# EAGLE design -Y_panel_FM_2U_Ver1_v1 (EAGLE 9.6.2)
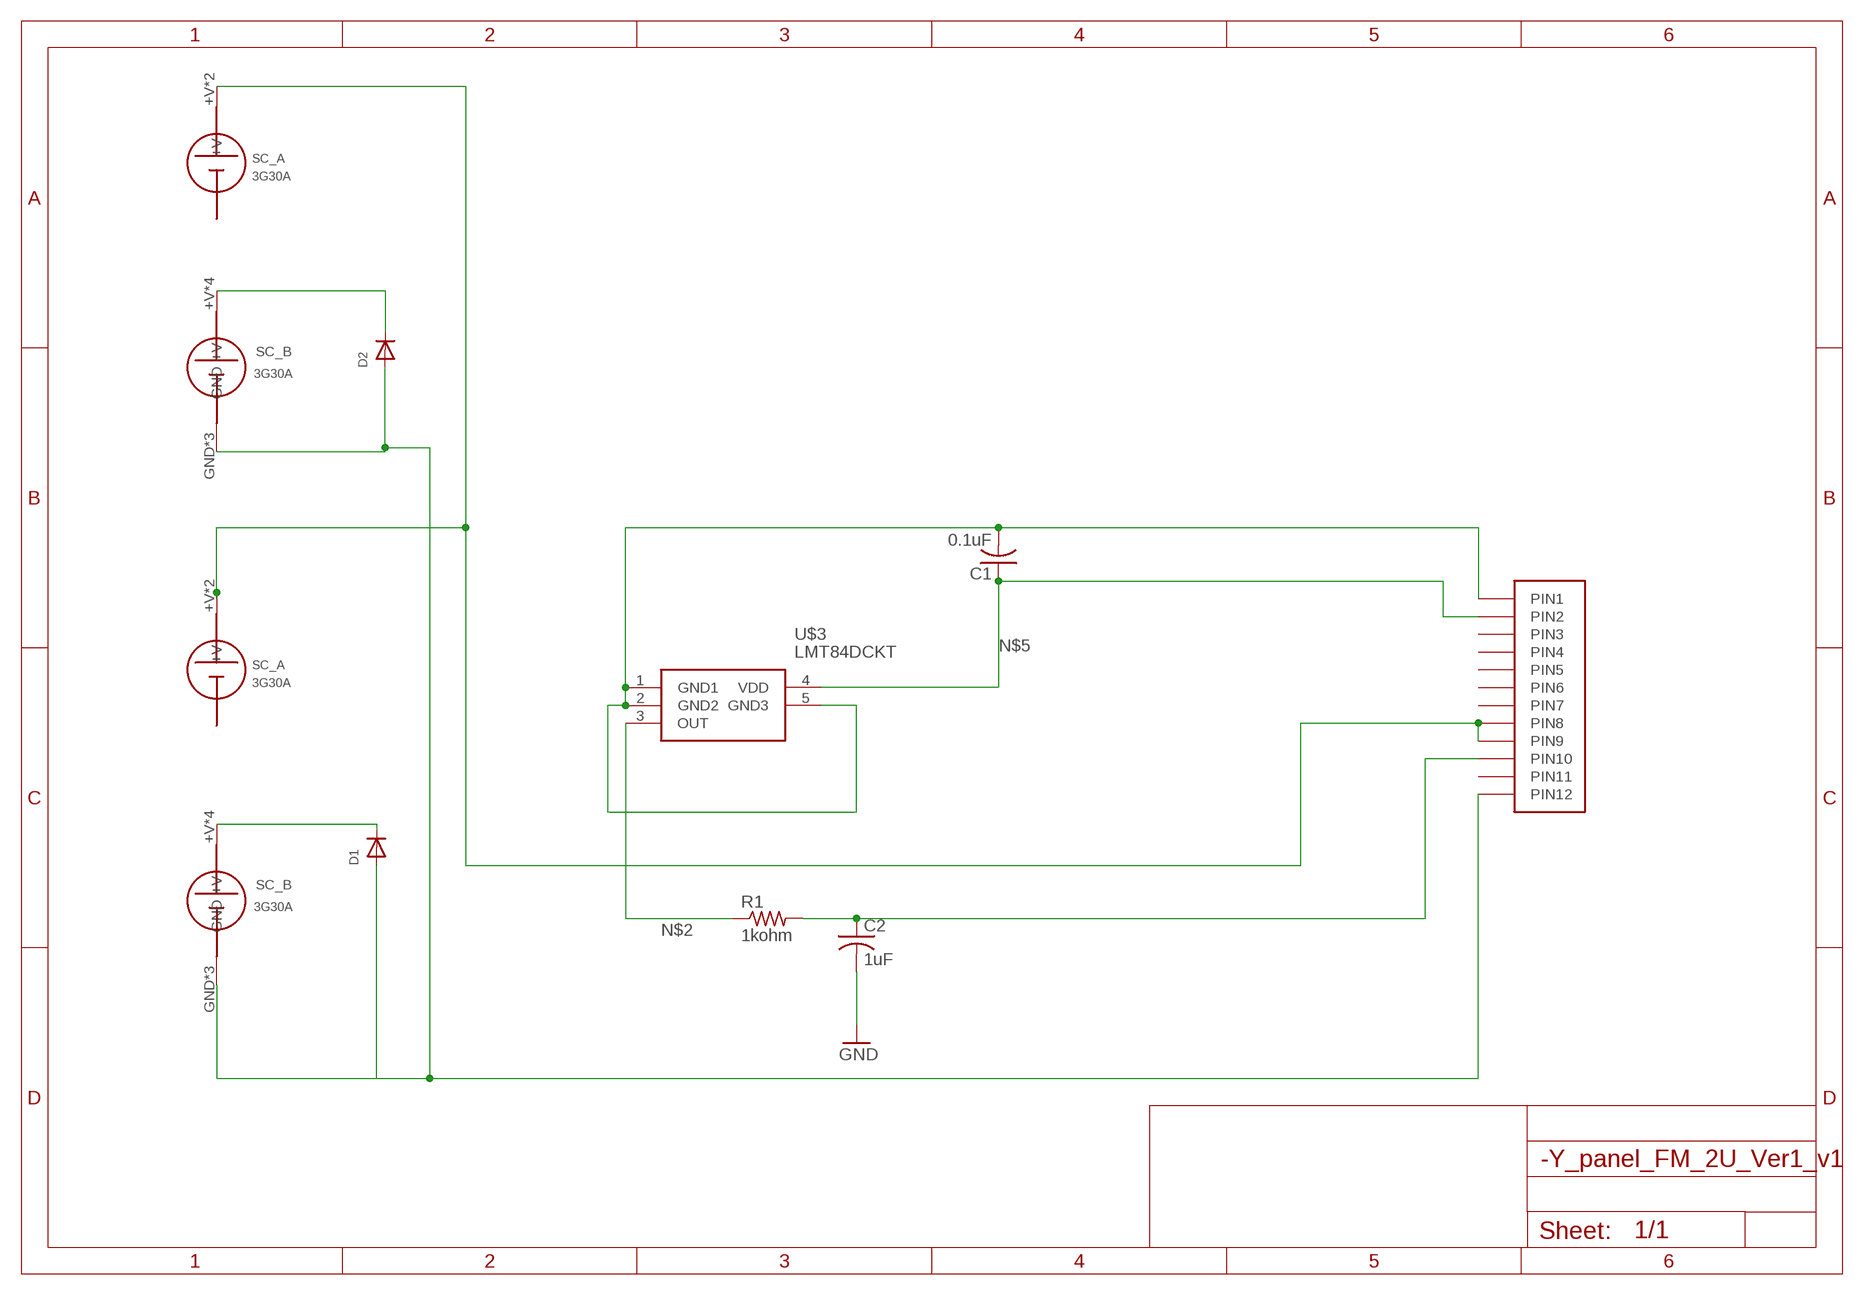
[diagram p0: schematic, sheet 1]

## Parts
C1  0.1uF  C-USC0805  [C0805]
C2  1uF  C-USC0805  [C0805]
D1  DIODE_SOD-123FL  [SOD-123FL]
D2  DIODE_SOD-123FL  [SOD-123FL]
R1  1kohm  R-US_R0402  [R0402]
SOLARCELL_A  SC_A  [SC_A]
SOLARCELL_A1  SC_A  [SC_A]
SOLARCELL_B  SC_B  [SC_B]
SOLARCELL_B1  SC_B  [SC_B]
U$1  HEADER12PIN  [HEADER12PIN]
U$3  LMT84DCKT  [SOT65P210X110-5N]

## Nets
+V: SOLARCELL_A1.+V SOLARCELL_A1.+V1(+V) SOLARCELL_A.+V SOLARCELL_A.+V1(+V) U$1.P8(PIN8) U$1.P9(PIN9)
+VB: D1.C SOLARCELL_B.+V SOLARCELL_B.+V2(+V) SOLARCELL_B.+V3(+V) SOLARCELL_B.+V4(+V)
GND: C1.2 C2.2 D1.A D2.A SOLARCELL_B1.GND SOLARCELL_B1.GND1(GND) SOLARCELL_B1.GND2(GND) SOLARCELL_B.GND SOLARCELL_B.GND1(GND) SOLARCELL_B.GND2(GND) U$1.P1(PIN1) U$1.P12(PIN12) U$3.1(GND1) U$3.2(GND2) U$3.5(GND3)
N$1: D2.C SOLARCELL_B1.+V SOLARCELL_B1.+V2(+V) SOLARCELL_B1.+V3(+V) SOLARCELL_B1.+V4(+V)
N$2: R1.1 U$3.3(OUT)
N$5: C1.1 U$1.P2(PIN2) U$3.4(VDD)
N$10: C2.1 R1.2 U$1.P10(PIN10)
Unconnected: U$1.P3(PIN3) U$1.P4(PIN4) U$1.P5(PIN5) U$1.P6(PIN6) U$1.P7(PIN7) U$1.P11(PIN11)

## Library data of the parts
C1 C2 = adafruit:C-US: CAPACITOR, American symbol
D1 D2 = adafruit:DIODE: Diode SMADIODE - SMA Surface Mount Package 20V 1A Schottky Diode Digikey: 641-1014-6-ND DO-1N4148 - Through Hole Small Current Diode SOD-123 20V 1 A (.5mV Vf) Schottky Diode - Digikey: MBRX120TPMSCT-ND SOD-323 10V 570mA (.38mV Vf, 3ns) Schottky Diode - Digikey: ZLLS410CT-ND SOD-523 30V 30mA Schottky Diode (RB751S-40TE61) - Digikey: RB751S-40TE61CT-ND SOT23-R/W - SOT23 Package (R = Solder Paste/Reflow Ovens, W = Hand-Soldering) BAT54Film 40V 300mA - Digikey: 497-7162-1-ND
R1 = adafruit:R-US_: RESISTOR, American symbol
SOLARCELL_A SOLARCELL_A1 = SC_A:SC_A
SOLARCELL_B = SC_B-2:SC_B
SOLARCELL_B1 = SC_B-2:SC_B; SPICEPREFIX: B
U$1 = BIRDS:HEADER12PIN
U$3 = LMT84DCKT:LMT84DCKT: 1.5V-Capable, 10 uA Analog Output Temperature Sensor in SC70 and TO-92 Source: Datasheet <http://uk.rs-online.com/web/p/products/8115860>; DESCRIPTION: 1.5V-Capable, 10 uA Analog Output Temperature Sensor in SC70 and TO-92; HEIGHT: 1.1mm; MANUFACTURER_NAME: Texas Instruments; MANUFACTURER_PART_NUMBER: LMT84DCKT; RS_PART_NUMBER: 8115860

## Board
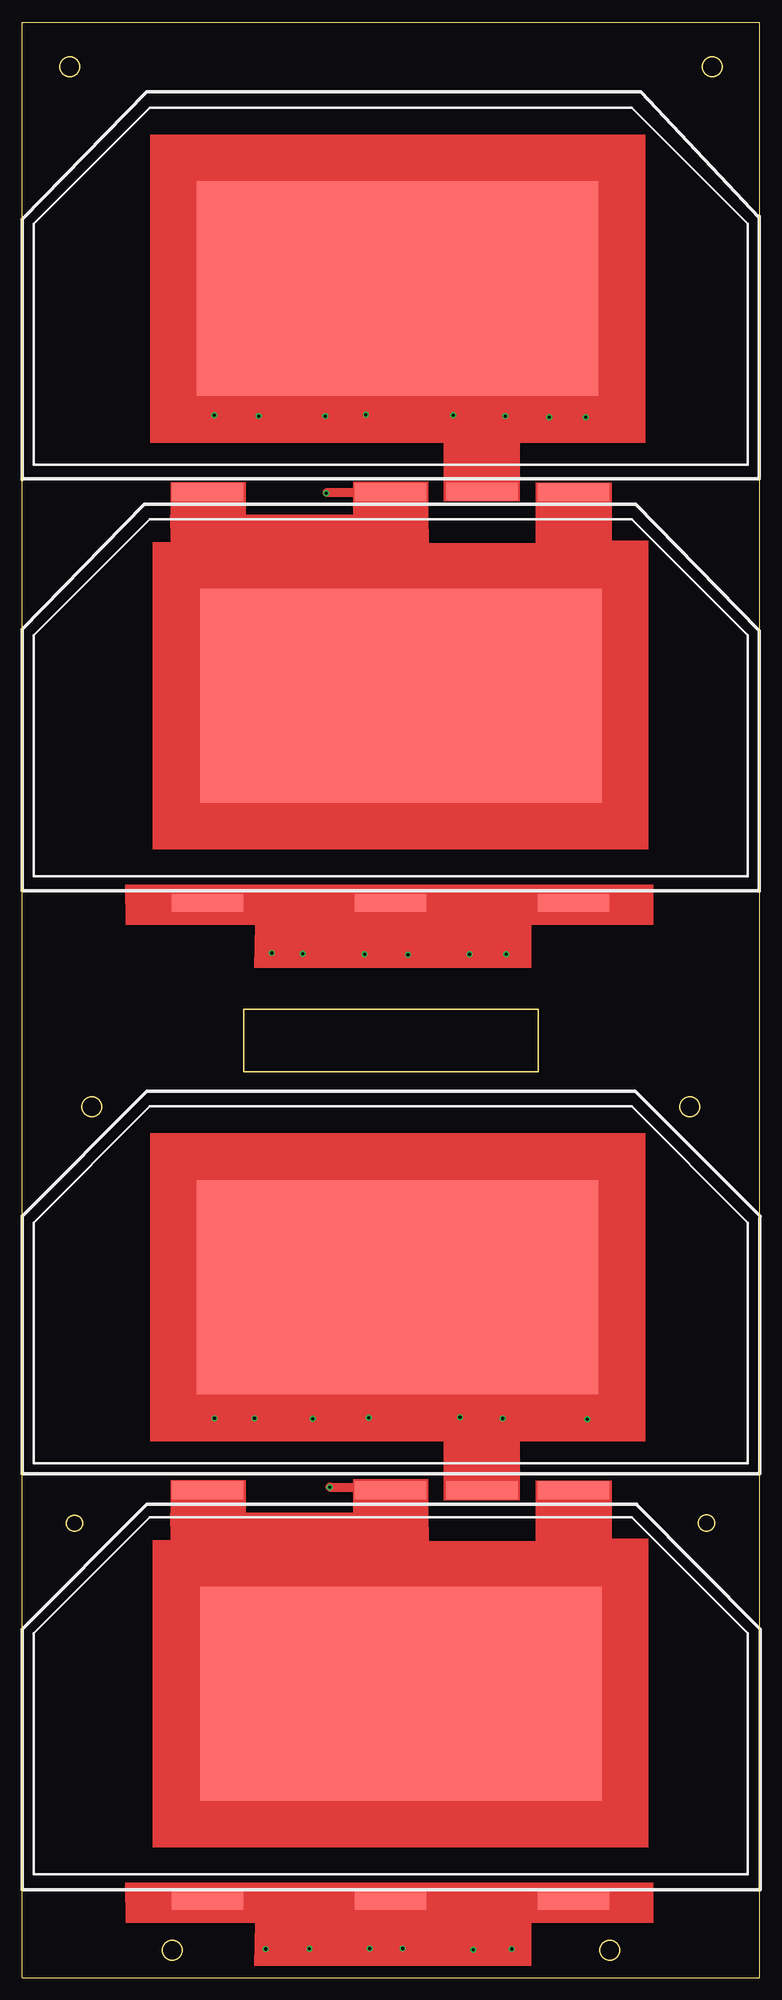
[diagram p1: board, top side]
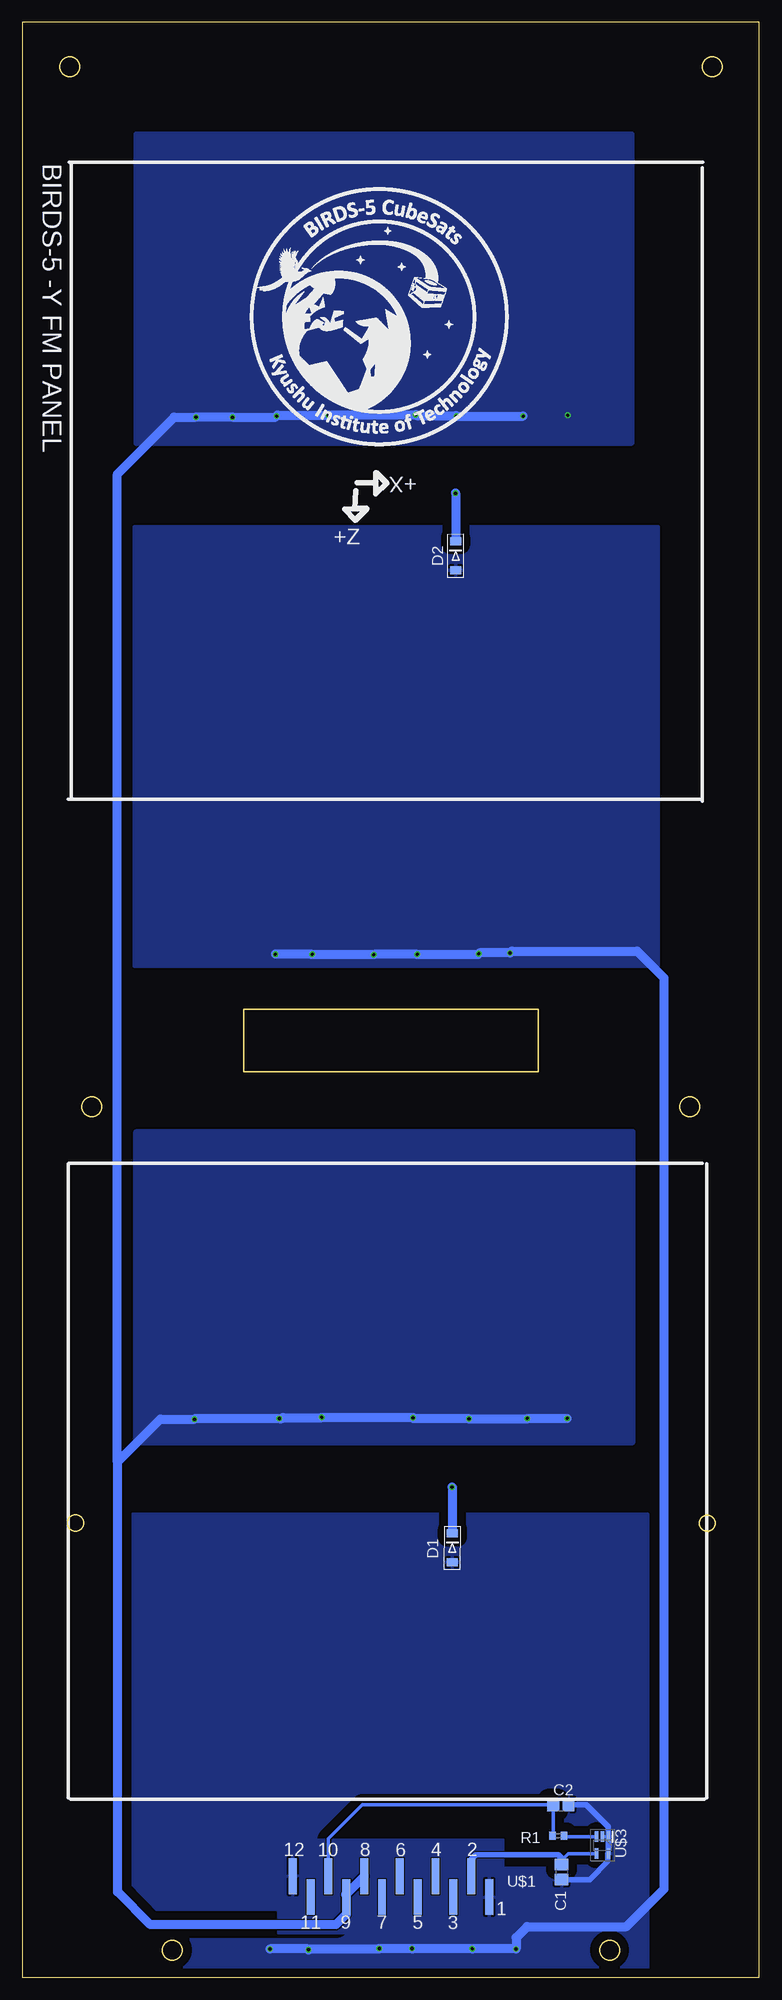
[diagram p2: board, bottom side, seen from below]

Size 82.6 x 219.1 mm. Coordinates in mm from the lower left corner, seen from the top.
Outline: 24.8,101.51 24.8,108.51 57.8,108.51 57.8,101.51 24.8,101.51
Outline: 0,0 82.6,0 82.6,219.1 0,219.1 0,0
Outline: circle at 74.8,97.6 radius 1.1
Outline: circle at 5.3,214.1 radius 1.1
Outline: circle at 77.3,214.1 radius 1.1
Outline: circle at 16.8,3.1 radius 1.1
Outline: circle at 65.8,3.1 radius 1.1
Outline: circle at 7.8,97.6 radius 1.1
Outline: circle at 5.85,50.92 radius 0.9
Outline: circle at 76.65,50.93 radius 0.9
Copper layers (1*16): Top 0.035mm / dielectric 1.53mm / Bottom 0.035mm
Design rules "pban_5mil-l2": minimum track width 5mil, minimum drill 0.3mm, track to track 5mil, track to pad 0.229mm, pad to pad 5mil, via to via 5mil, smd to smd 5mil, copper to edge 0.5mm, drill to drill 0.5mm, minimum pad ring 0.15mm, minimum via ring 0.15mm, stop-mask expansion 4mil, vias tented up to drill 0.35mm, thermal gap 10mil

### Footprints (pad centres in the part's own frame; a part is rotated, then mirrored left to right if it is on the bottom)
C0805 = smd 1.3 x 1.5: 1 -0.85,0; 2 0.85,0
SOD-123FL = smd 0.91 x 1.22 bottom: A 1.637,0; C -1.637,0
R0402 = smd 0.7 x 0.9: 1 -0.65,0; 2 0.65,0
SC_A = smd 45 x 24: +V 40.75,19.75 | smd 8 x 2: +V1 50.25,-3
SC_B = smd 45 x 24: +V 41.14,20.22 | smd 8 x 2: +V2 19.5,43; +V3 40,43; +V4 60.5,43; GND 60.5,-3; GND1 19.5,-3; GND2 40,-3
HEADER12PIN = smd 4 x 0.89: P1 0,0; P2 2.35,2; P3 0,4; P4 2.35,6; P5 0,8; P6 2.35,10; P7 0,12; P8 2.35,14; P9 0,16; P10 2.35,18; P11 0,20; P12 2.35,22
SOT65P210X110-5N = smd 1.2 x 0.4: 1 -0.95,0.65; 2 -0.95,0; 3 -0.95,-0.65; 4 0.95,-0.65; 5 0.95,0.65

### Placement (x,y rotation side)
C1  22.18,11.85 270 bottom
C2  22.26,19.39 0 bottom
D1  34.41,48.17 270 top
D2  34.04,159.33 270 top
R1  22.54,15.93 180 bottom
SOLARCELL_A  1.27,57.62 0 top
SOLARCELL_A1  1.27,169.52 0 top
SOLARCELL_B  1.27,11.61 0 top
SOLARCELL_B1  1.27,123.43 0 top
U$1  30.3,9.03 90 bottom
U$3  17.59,14.86 270 bottom

### Tracks (layer width: path | path; a pad name or v marks a point on that pad's centre or on a via)
+V  (via drill 0.35)
  Top 0.152: 41.67,75.38 42.02,75.73
  Top 1.016: SOLARCELL_A.+V1 53.82,56.92 v53.82,62.66 | SOLARCELL_A1.+V1 51.52,172.39 v54.11,174.98 | v38.82,62.75 38.82,72.53 41.67,75.38 | SOLARCELL_A.+V 42.02,75.73 | v38.5,175.14 38.5,181.59 42.02,185.11 SOLARCELL_A1.+V
  Bottom 0.152: 46.3,9.33 U$1.P9 | 38.86,62.79 v38.82,62.75 | 26.06,62.62 v26.01,62.67 | 54.23,174.86 v54.11,174.98 | 63.22,62.66 v63.3,62.58
  Bottom 1.016: U$1.P8 46.38,9.3 46.3,9.33 | U$1.P9 46.3,7.11 47.47,5.93 68.24,5.93 71.91,9.61 71.91,57.78 | 71.91,57.78 71.95,57.74 71.95,168.49 65.58,174.86 v63.14,174.86 v59.05,174.86 54.23,174.86 | 71.91,57.78 67.12,62.58 v63.3,62.58 | 38.86,62.79 v49.04,62.79 49.06,62.77 53.4,62.77 53.51,62.66 v53.82,62.66 63.22,62.66 | 26.06,62.62 v32.55,62.62 32.6,62.67 38.74,62.67 v38.82,62.75 | v26.01,62.67 v21.54,62.67 | 38.51,175.13 48.26,175.13 v48.3,175.09 54,175.09 v54.11,174.98 | v38.5,175.14 38.51,175.13 | v26.49,174.98 v33.96,174.98 34.01,175.03 38.41,175.03 38.51,175.13
  other vias: 21.5,175.06
  pour Bottom (isolate 0.305): 14.18,94.81 14.18,60.07 14.29,59.96 69.83,59.96 69.89,60.02 69.89,94.68 69.76,94.81
  pour Bottom (isolate 0.305): 14.29,206.57 14.29,172.02 14.4,171.91 69.79,171.91 69.83,171.95 69.83,206.57
+VB  (via drill 0.35)
  Top 0.152: 28.12,43.41 28.17,43.36 | 51.3,31.87 51.41,31.87 51.37,31.83 | 52.18,31.45 44,31.45 43.62,31.83 SOLARCELL_B.+V | SOLARCELL_B.+V3 41.27,51.82
  Top 1.016: SOLARCELL_B.+V2 28.12,47.26 28.12,43.41 | 28.17,43.36 32.81,43.36 41.27,51.82 | 51.3,31.87 43.72,39.45 43.72,52.16 SOLARCELL_B.+V3 40.91,54.97 v34.46,54.97 | SOLARCELL_B.+V4 61.77,41.04 52.18,31.45 | SOLARCELL_B.+V 51.37,31.83
  Bottom 1.016: v34.46,54.97 34.41,54.92 D1.C
GND  (via drill 0.35)
  Top 0.152: v32.17,3.23 32.16,3.22 26.77,8.61 SOLARCELL_B.GND1 | SOLARCELL_B1.GND2 41.27,120.42
  Top 1.016: SOLARCELL_B.GND SOLARCELL_B.GND2 42.61,7.27 v42.61,3.27 | SOLARCELL_B1.GND1 24.26,120.43 27.96,116.73 v27.96,114.82 | 41.27,120.42 43.22,118.47 v43.22,114.63 | SOLARCELL_B1.GND2 SOLARCELL_B1.GND
  Bottom 0.152: 38.9,3.23 v38.94,3.27 | v42.61,3.27 42.65,3.23 | 32.16,3.22 v32.17,3.23 | v50.53,3.12 50.63,3.22 | 31.37,114.82 v31.44,114.75 | 43.18,114.67 v43.22,114.63 | v50.11,114.68 50.24,114.68 50.19,114.63 | v27.96,114.82 27.76,115.02
  Bottom 0.406: U$3.1 U$3.2
  Bottom 0.61: C1.2 19.01,11 16.98,13.03 16.98,13.87 U$3.5 U$3.1 16.94,16.9 19.43,19.39 C2.2
  Bottom 1.016: v32.17,3.23 38.9,3.23 | v50.53,3.12 50.42,3.23 42.65,3.23 | 32.16,3.22 v27.28,3.22 27.28,4.48 26.03,5.74 14.9,5.74 10.72,9.92 10.72,112.04 13.7,115.02 27.76,115.02 | v38.94,3.27 v42.61,3.27 | 50.63,3.22 v54.84,3.22 | v27.96,114.82 31.37,114.82 | 43.18,114.67 v38.35,114.67 31.52,114.67 v31.44,114.75 | 50.24,114.68 v54.24,114.68 | v43.22,114.63 50.19,114.63
  pour Bottom: 28.63,15.53 28.63,4.95 53.99,4.95 53.99,15.53
  pour Bottom (isolate 1): 70.26,50.25 70.26,0.87 12.54,0.87 12.54,51.94 70.22,51.94 70.28,51.88 70.28,50.21
  pour Bottom (isolate 1): 11.36,162.58 11.36,113.34 70.06,113.34 70.06,162.58
N$1  (via drill 0.35)
  Top 0.152: 32.86,154.34 32.86,153.29 34.21,153.29 34.21,151.85 SOLARCELL_B1.+V | 46.05,143.51 45.91,143.65 SOLARCELL_B1.+V | SOLARCELL_B1.+V 44.84,146.08 44.84,149.73 | v34.06,166.35 34.14,166.43
  Top 1.016: SOLARCELL_B1.+V2 32.86,154.34 | 44.84,149.73 41.27,153.3 SOLARCELL_B1.+V3 34.14,166.43 | SOLARCELL_B1.+V4 61.77,159.23 46.05,143.51
  Bottom 1.016: v34.06,166.35 34.06,160.98 D2.C
N$2
  Bottom 0.152: 21.77,15.81 R1.1
  Bottom 0.406: U$3.3 21.77,15.81
N$5
  Bottom 0.406: U$3.4 21.42,13.91 22.18,13.14 C1.1
  Bottom 0.61: C1.1 22.18,13.37 22.57,13.77 31.82,13.77 32.3,13.28 U$1.P2
N$10
  Bottom 0.406: R1.2 23.11,16.01 C2.1 44.49,19.39 48.3,15.58 U$1.P10

### Text on the board
bPlace: BIRDS-5 -Y FM PANEL | +X | +Z
bNames: 2 | 4 | 6 | 8 | 10 | 12 | U$1 | 1 | 3 | 5 | 7 | 9 | 11